# EAGLE design commonBoardPtV0.5-2014-11-05 (EAGLE 7.1.0)
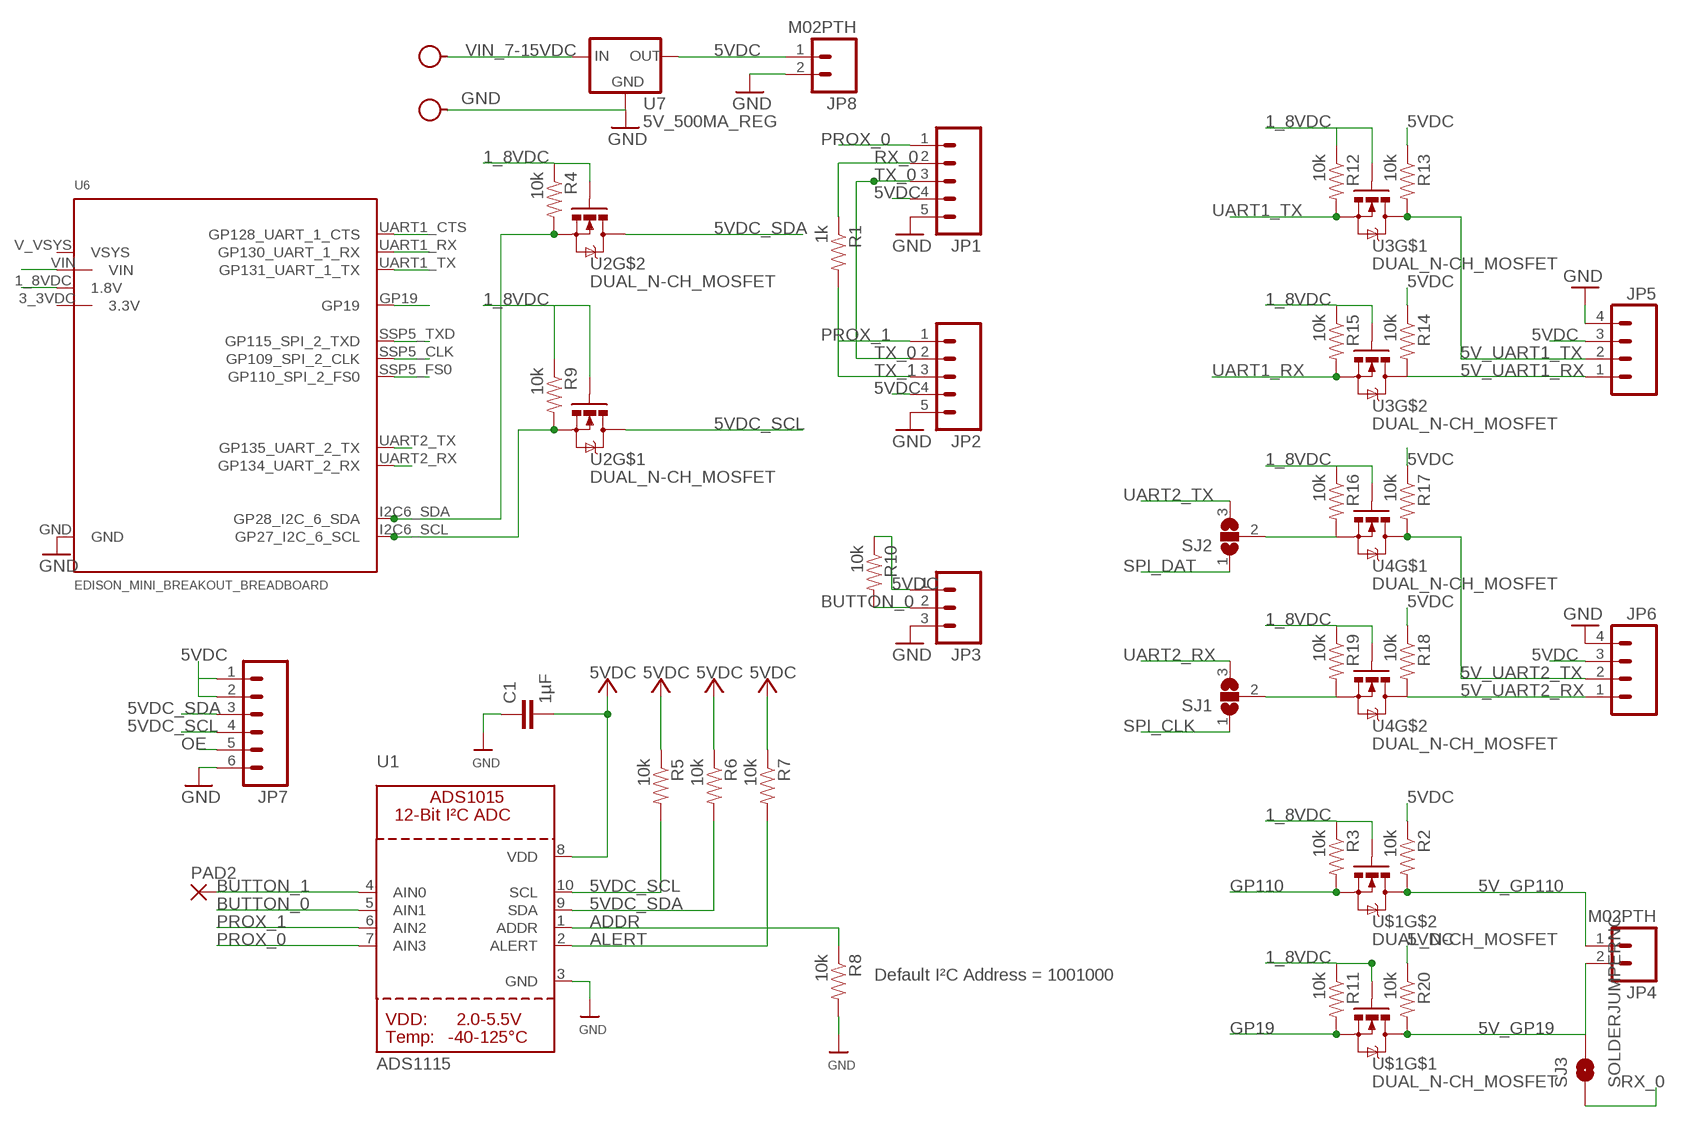
[diagram p0: schematic, sheet 1]

## Parts
C1  1µF  CAP0603-CAP  [0603-CAP]
GND  SEW_HOLE-SMALL  [SIMPLE_HOLE_SM]
JP1  M05PTH  [1X05]
JP2  M05PTH  [1X05]
JP3  M03PTH  [1X03]
JP4  M02PTH  [1X02]
JP5  M04PTH  [1X04]
JP6  M04PTH  [1X04]
JP7  M06SIP  [1X06]
JP8  M02PTH  [1X02]
PAD2  2,15/1,0  [2,15/1,0]
R1  1k  RESISTOR0603-RES  [0603-RES]
R2  10k  RESISTOR0603-RES  [0603-RES]
R3  10k  RESISTOR0603-RES  [0603-RES]
R4  10k  RESISTOR0603-RES  [0603-RES]
R5  10k  RESISTOR0603-RES  [0603-RES]
R6  10k  RESISTOR0603-RES  [0603-RES]
R7  10k  RESISTOR0603-RES  [0603-RES]
R8  10k  RESISTOR0603-RES  [0603-RES]
R9  10k  RESISTOR0603-RES  [0603-RES]
R10  10k  RESISTOR0603-RES  [0603-RES]
R11  10k  RESISTOR0603-RES  [0603-RES]
R12  10k  RESISTOR0603-RES  [0603-RES]
R13  10k  RESISTOR0603-RES  [0603-RES]
R14  10k  RESISTOR0603-RES  [0603-RES]
R15  10k  RESISTOR0603-RES  [0603-RES]
R16  10k  RESISTOR0603-RES  [0603-RES]
R17  10k  RESISTOR0603-RES  [0603-RES]
R18  10k  RESISTOR0603-RES  [0603-RES]
R19  10k  RESISTOR0603-RES  [0603-RES]
R20  10k  RESISTOR0603-RES  [0603-RES]
SJ1  SJ2W  [SJ_2]
SJ2  SJ2W  [SJ_2]
SJ3  SOLDERJUMPERNC  [SJ_2S]
U1  ADS1115  ADC_ADS1015  [MSOP10]
U2  DUAL_N-CH_MOSFET  [SOT363_DUAL_N_MOSFET]
U3  DUAL_N-CH_MOSFET  [SOT363_DUAL_N_MOSFET]
U4  DUAL_N-CH_MOSFET  [SOT363_DUAL_N_MOSFET]
U6  EDISON_MINI_BREAKOUT_BREADBOARD  [EDISON_MINI_BREAK_BREADBOARD]
U7  5V_500MA_REG  [5V_500MA_REG]
U$1  DUAL_N-CH_MOSFET  [SOT363_DUAL_N_MOSFET]
VIN_7-15VDC  SEW_HOLE-SMALL  [SIMPLE_HOLE_SM]

## Nets
1_8VDC: R3.1 R4.1 R9.1 R11.1 R12.1 R15.1 R16.1 R19.1 U2.2(G) U2.5(G) U3.2(G) U3.5(G) U4.2(G) U4.5(G) U6.1_8VDC(1.8V) U$1.2(G) U$1.5(G)
5V_GP19: JP4.2 R20.2 SJ3.2 U$1.3(D)
5V_GP110: JP4.1 R2.2 U$1.6(D)
5V_UART1_RX: JP5.1 R14.2 U3.6(D)
5V_UART1_TX: JP5.2 R13.2 U3.3(D)
5V_UART2_RX: JP6.1 R18.2 U4.6(D)
5V_UART2_TX: JP6.2 R17.2 U4.3(D)
5VDC: C1.2 JP1.4 JP2.4 JP3.1 JP5.3 JP6.3 JP7.1 JP7.2 JP8.1 R2.1 R5.1 R6.1 R7.1 R10.1 R13.1 R14.1 R17.1 R18.1 R20.1 U1.8(VDD) U7.OUT ; supply symbol labelled VDD
5VDC_SCL: JP7.4 R5.2 U1.10(SCL) U2.3(D)
5VDC_SDA: JP7.3 R6.2 U1.9(SDA) U2.6(D)
ADDR: R8.1 U1.1(ADDR)
ALERT: R7.2 U1.2(ALERT)
BUTTON_0: JP3.2 R10.2 U1.5(AIN1)
BUTTON_1: PAD2.1(P) U1.4(AIN0)
GND: C1.1 GND.P$1 JP1.5 JP2.5 JP3.3 JP5.4 JP6.4 JP7.6 JP8.2 R8.2 U1.3(GND) U6.GND U7.GND
GP19: R11.2 U6.GP19 U$1.4(S)
GP110: R3.2 U6.SSP5_FS0(GP110_SPI_2_FS0) U$1.1(S)
N$1: R9.2 U2.4(S) U6.I2C6_SCL(GP27_I2C_6_SCL)
N$2: U6.UART1_CTS(GP128_UART_1_CTS)
N$4: R4.2 U2.1(S) U6.I2C6_SDA(GP28_I2C_6_SDA)
OE: JP7.5
P1: R16.2 SJ2.2 U4.4(S)
P2: R19.2 SJ1.2 U4.1(S)
PROX_0: JP1.1 U1.7(AIN3)
PROX_1: JP2.1 U1.6(AIN2)
RX_0: JP1.2 R1.1 SJ3.1
SPI_CLK: SJ1.1 U6.SSP5_CLK(GP109_SPI_2_CLK)
SPI_DAT: SJ2.1 U6.SSP5_TXD(GP115_SPI_2_TXD)
TX_0: JP1.3 JP2.2
TX_1: JP2.3 R1.2
UART1_RX: R15.2 U3.1(S) U6.UART1_RX(GP130_UART_1_RX)
UART1_TX: R12.2 U3.4(S) U6.UART1_TX(GP131_UART_1_TX)
UART2_RX: SJ1.3 U6.UART2_RX(GP134_UART_2_RX)
UART2_TX: SJ2.3 U6.UART2_TX(GP135_UART_2_TX)
VIN_7-15VDC: U6.VIN U7.IN VIN_7-15VDC.P$1
Unconnected: U6.3_3VDC(3.3V) U6.V_VSYS(VSYS)

## Notes on the sheet
- Default I²C Address = 1001000

## Library data of the parts
C1 = SparkFun-Capacitors:CAP: Capacitor Standard 0603 ceramic capacitor, and 0.1" leaded capacitor.
GND VIN_7-15VDC = LilyPad-Wearables:SEW_HOLE-SMALL: .070" hole with 20mil annular ring
JP1 JP2 = SparkFun-Connectors:M05: Header 5 Standard 5-pin 0.1" header. Use with straight break away headers (SKU : PRT-00116), right angle break away headers (PRT-00553), swiss pins (PRT-00743), machine pins (PRT-00117), and female headers (PRT-00115). Molex polarized connector foot print use with SKU : PRT-08230 with associated crimp pins and housings.
JP3 = SparkFun-Connectors:M03: Header 3 Standard 3-pin 0.1" header. Use with straight break away headers (SKU : PRT-00116), right angle break away headers (PRT-00553), swiss pins (PRT-00743), machine pins (PRT-00117), and female headers (PRT-00115). Molex polarized connector foot print use with SKU : PRT-08232 with associated crimp pins and housings.
JP4 JP8 = SparkFun-Connectors:M02: Standard 2-pin 0.1" header. Use with - straight break away headers ( PRT-00116) - right angle break away headers (PRT-00553) - swiss pins (PRT-00743) - machine pins (PRT-00117) - female headers (PRT-00115) Molex polarized connector foot print use with: PRT-08233 with associated crimp pins and housings. 2.54_SCREWTERM for use with PRT-10571. 3.5mm Screw Terminal footprints for PRT-08084 5mm Screw Terminal footprints for use with PRT-08433
JP5 JP6 = SparkFun-Connectors:M04: Header 4 Standard 4-pin 0.1" header. Use with straight break away headers (SKU : PRT-00116), right angle break away headers (PRT-00553), swiss pins (PRT-00743), machine pins (PRT-00117), and female headers (PRT-00115). Molex polarized connector foot print use with SKU : PRT-08231 with associated crimp pins and housings. 1MM SMD Version SKU: PRT-10208
JP7 = SparkFun-Connectors:M06: Header 6 Standard 6-pin 0.1" header. Use with straight break away headers (SKU : PRT-00116), right angle break away headers (PRT-00553), swiss pins (PRT-00743), machine pins (PRT-00117), and female headers (PRT-00115). Molex polarized connector foot print use with SKU : PRT-08094 with associated crimp pins and housings. NOTES ON THE VARIANTS LOCK and LOCK_LONGPADS... This footprint was designed to help hold the alignment of a through-hole component (i.e. 6-pin header) while soldering it into place. You may notice that each hole has been shifted either up or down by 0.005 of an inch from it's more standard position (which is a perfectly straight line). This slight alteration caused the pins (the squares in the middle) to touch the edges of the holes. Because they are alternating, it causes a "brace" to hold the component in place. 0.005 has proven to be the perfect amount of "off-center" position when using our standard breakaway headers. Although looks a little odd when you look at the bare footprint, once you have a header in there, the alteration is very hard to notice. Also,if you push a header all the way into place, it is covered up entirely on the bottom side. This idea of altering the position of holes to aid alignment will be further integrated into the Sparkfun Library for other footprints. It can help hold any component with 3 or more connection pins.
PAD2 = wirepad:2,15/1,0: THROUGH-HOLE PAD
R1-R20 = SparkFun-Passives:RESISTOR: Resistor Basic schematic elements and footprints for 0603, 1206, and PTH resistors.
SJ1 SJ2 = jumper:SJ2W: SMD solder JUMPER
SJ3 = SparkFun-Passives:SOLDERJUMPER: Solder Jumper Standard SMD solder jumper. Used to automate production. Two varients : Normally Open and Normally Closed are the same, but have different paste layers. NC will have a large amount of paste and should jumper during reflow.
U1 = microbuilder:ADC_ADS1015: ADS1015 - 12-bit 4-Channel I2C ADC with Internal PGA VDD: 2.0-5.5V Sampling Rate: 3.3ksps Gain Settings: 2/3, 1, 2, 4, 8, 16 I2C Address: ADDR low = 1001000x, ADDR high = 1001001x Internal Comparator The ADS1015 includes an internal comparator that can be set to output a high-level on ALERT when the conversion results exceeeds a pre-defined upper level, and will deassert itself when the level falls below a pre-defined lower threshold level. It can also be set to windowed mode where the ALERT pin will be asserted if the data exceeds the upper threshold or falls below the lower threshold.
U2-U4 U$1 = bss138_part:DUAL_N-CH_MOSFET
U6 = Edison:EDISON_MINI_BREAKOUT_BREADBOARD
U7 = pololu:5V_500MA_REG

## Board
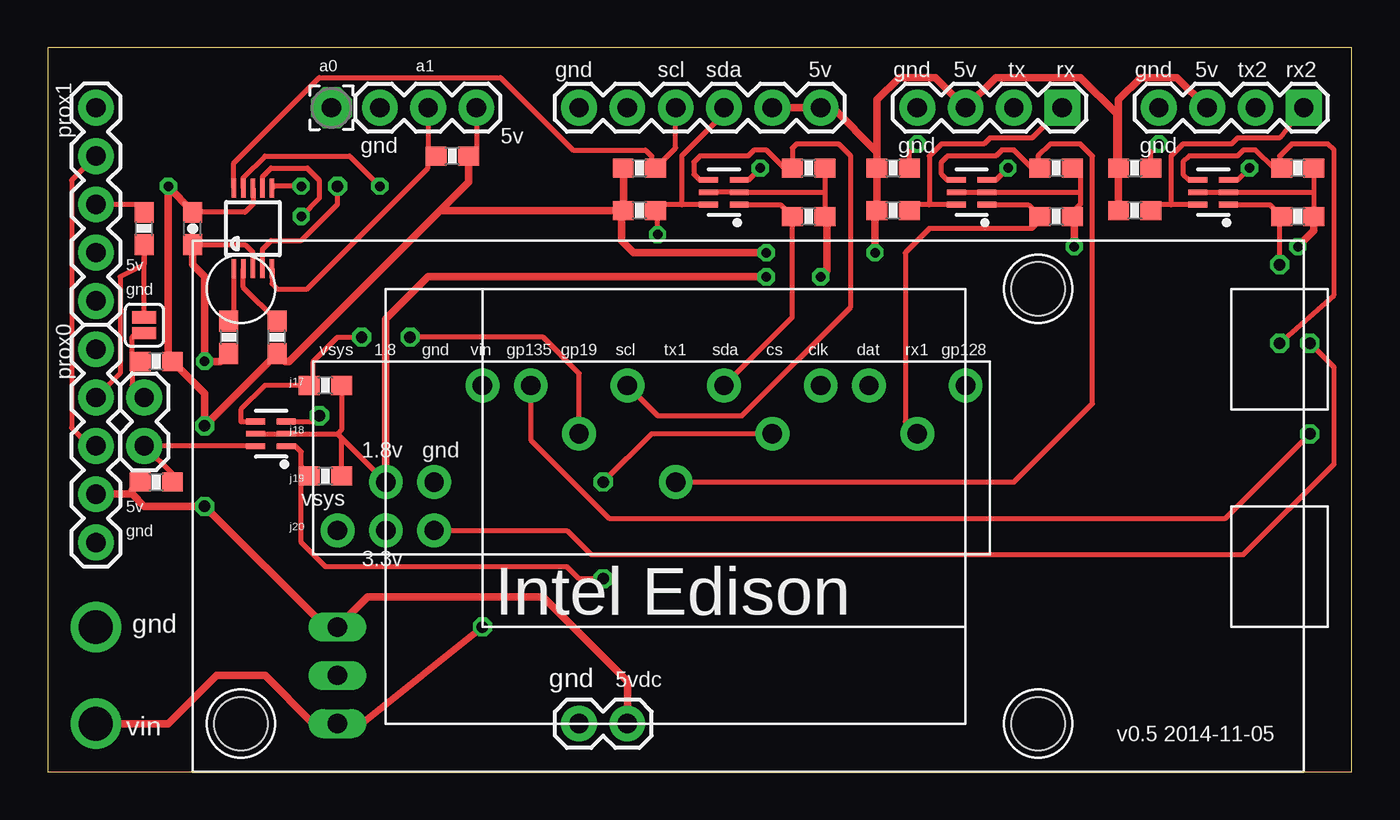
[diagram p1: board, top side]
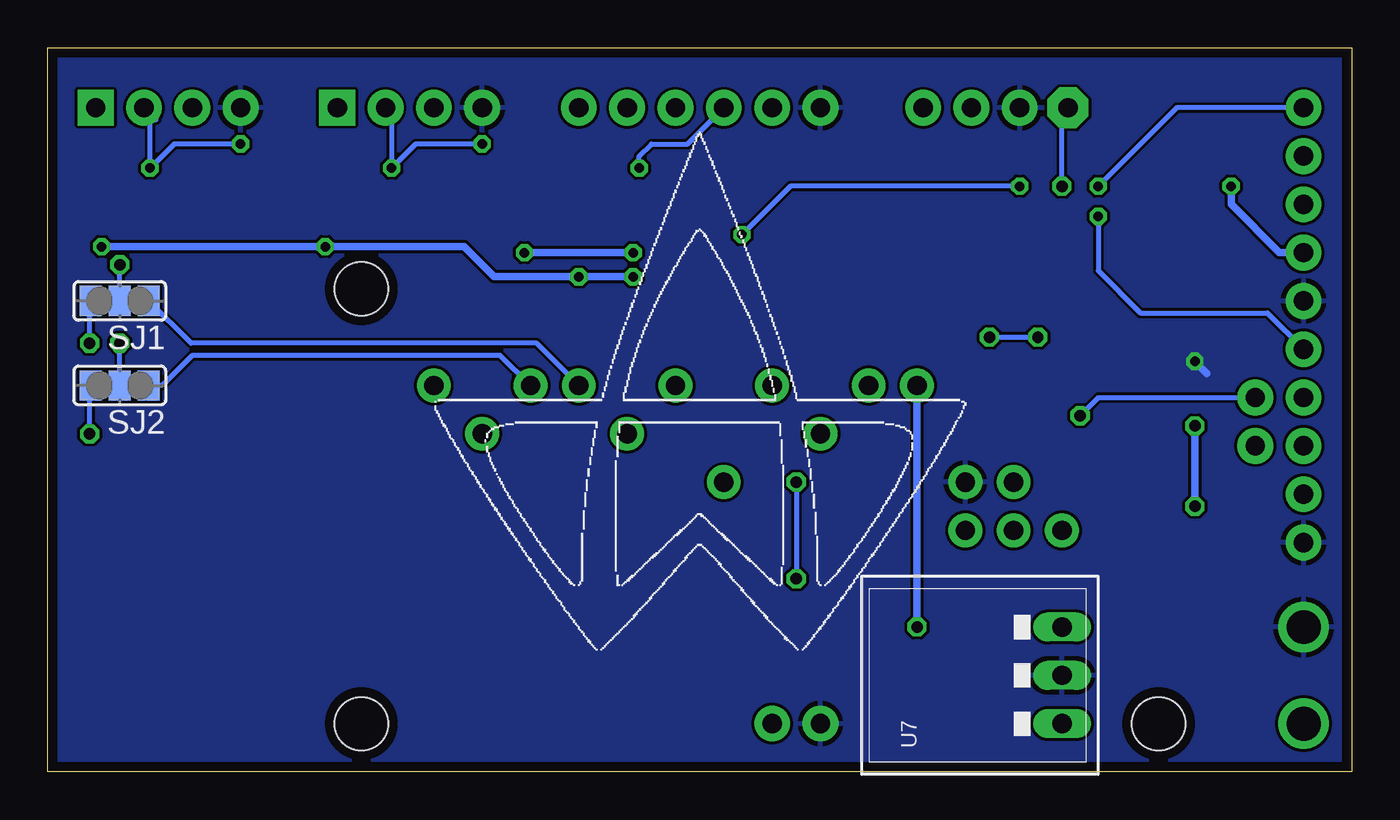
[diagram p2: board, bottom side, seen from below]

Size 68.57 x 38.09 mm. Coordinates in mm from the lower left corner, seen from the top.
Outline: 0,0 68.57,0 68.57,38.09 0,38.09 0,0
Copper layers (1*16): Top 0.0178mm / dielectric 59mil / Bottom 0.0178mm
Design rules "SSC-EAGLE-2Lyr_v1.0.0.3": minimum track width 6mil, minimum drill 14mil, track to track 6mil, track to pad 6mil, pad to pad 6mil, via to via 6mil, smd to smd 6mil, copper to edge 20mil, drill to drill 16mil, minimum pad ring 8mil, minimum via ring 8mil, stop-mask expansion 3mil, vias tented up to drill 0mil, thermal gap 10mil
Holes 2.8 mm at 10.16,2.54 52.07,2.54 52.07,25.4

### Footprints (pad centres in the part's own frame; a part is rotated, then mirrored left to right if it is on the bottom)
0603-CAP = smd 1.1 x 1: 1 -0.85,0; 2 0.85,0
SIMPLE_HOLE_SM = drill 1.778 pad 2.286: P$1 0,0
1X05 = drill 1.016 pad 1.88: 1 0,0; 2 2.54,0; 3 5.08,0; 4 7.62,0; 5 10.16,0
1X03 = drill 1.016 pad 1.88: 1 0,0; 2 2.54,0; 3 5.08,0
1X02 = drill 1.016 pad 1.88: 1 0,0; 2 2.54,0
1X04 = drill 1.016 pad 1.88 square: 1 0,0 | drill 1.016 pad 1.88: 2 2.54,0; 3 5.08,0; 4 7.62,0
1X06 = drill 1.016 pad 1.88: 1 0,0; 2 2.54,0; 3 5.08,0; 4 7.62,0; 5 10.16,0; 6 12.7,0
2,15/1,0 = drill 1.016 pad 2.159 octagon: 1 0,0
0603-RES = smd 1.1 x 1: 1 -0.85,0; 2 0.85,0
SJ_2 = smd 1.168 x 1.6: 1 -1.524,0; 2 0,0; 3 1.524,0
SJ_2S = smd 0.635 x 1.27: 1 -0.412,0; 2 0.412,0
MSOP10 = smd 0.25 x 1: 1 -1,-2.113; 2 -0.5,-2.113; 3 0,-2.113; 4 0.5,-2.113; 5 1,-2.113; 6 1,2.113; 7 0.5,2.113; 8 0,2.113; 9 -0.5,2.113; 10 -1,2.113
SOT363_DUAL_N_MOSFET = smd 0.3 x 0.99: 1 -0.65,-0.8; 2 0,-0.8; 3 0.65,-0.8; 4 0.65,0.81; 5 0,0.81; 6 -0.65,0.81
EDISON_MINI_BREAK_BREADBOARD = drill 1.016 pad 1.778: 1_8VDC 2.54,2.54; 3_3VDC 2.54,0; GND 5.08,2.54; GP19 12.7,5.08; I2C6_SCL 15.24,7.62; I2C6_SDA 20.32,7.62; SSP5_CLK 25.4,7.62; SSP5_FS0 22.86,5.08; SSP5_TXD 27.94,7.62; UART1_CTS 33.02,7.62; UART1_RX 30.48,5.08; UART1_TX 17.78,2.54; UART2_RX 5.08,0; UART2_TX 10.16,7.62; V_VSYS 0,0; VIN 7.62,7.62
5V_500MA_REG = drill 1.016 long: GND 0,0; IN -2.54,0; OUT 2.54,0

### Placement (x,y rotation side)
C1  7.62,28.57 90 top
GND  2.54,7.62 0 top
JP1  2.54,22.23 270 top
JP2  2.54,34.92 270 top
JP3  22.54,34.92 180 top
JP4  5.08,17.14 90 top
JP5  53.34,34.92 180 top
JP6  66.04,34.92 180 top
JP7  40.64,34.92 180 top
JP8  30.48,2.54 180 top
PAD2  14.92,34.92 0 top
R1  5.08,28.57 90 top
R2  5.71,15.24 0 top
R3  14.61,15.56 180 top
R4  40.01,29.21 180 top
R5  31.11,31.75 0 top
R6  31.11,29.53 0 top
R7  12.06,22.86 90 top
R8  9.53,22.86 270 top
R9  40.01,31.75 180 top
R10  21.27,32.38 180 top
R11  14.61,20.32 180 top
R12  53.02,31.75 180 top
R13  44.45,31.75 0 top
R14  44.45,29.53 0 top
R15  53.02,29.21 180 top
R16  65.72,31.75 180 top
R17  57.15,31.75 0 top
R18  57.15,29.53 0 top
R19  65.72,29.21 180 top
R20  5.71,21.59 180 top
SJ1  64.77,24.77 180 bottom
SJ2  64.77,20.32 180 bottom
SJ3  5.08,23.5 270 top
U1  10.79,28.57 0 top
U2  35.56,30.48 90 top
U3  48.58,30.48 90 top
U4  61.28,30.48 90 top
U6  15.24,12.7 0 top
U7  15.24,5.08 90 bottom
U$1  11.75,17.78 90 top
VIN_7-15VDC  2.54,2.54 0 top

### Tracks (layer width: path | path; a pad name or v marks a point on that pad's centre or on a via)
1_8VDC  (via drill 0.5)
  Top 0.254: U3.5 U3.2 54.29,30.48 | R12.1 54.29,31.33 54.29,30.48 | 54.29,30.48 54.29,29.84 53.87,29.43 R15.1 | R16.1 66.57,30.48 | 66.57,30.48 R19.1 | 66.57,30.48 U4.2 U4.5 | U2.5 U2.2 40.85,30.48 | R9.1 40.85,30.48 | 40.85,30.48 R4.1 | 15.46,17.57 U6.1_8VDC | 15.24,17.78 U$1.2 U$1.5 | R11.1 15.46,18 15.24,17.78 | R3.1 15.46,17.57 | 15.46,17.57 15.24,17.78
  Top 0.406: v37.78,26.04 20,26.04 17.78,23.81 U6.1_8VDC 17.78,17.14 | v40.64,26.04 40.96,26.35 40.96,29.11 R4.1 | v65.72,27.62 66.57,28.47 R19.1 | R15.1 53.98,29.21 v53.98,27.62
  Bottom 0.406: v37.78,26.04 v40.64,26.04 45.09,26.04 46.67,27.62 v53.98,27.62 v65.72,27.62
5V_GP19  (via drill 0.6)
  Top 0.254: U$1.3 13.98,18.43 v14.29,18.73 | SJ3.2 4.57,22.99 4.45,22.86 4.45,22.01 | 4.45,22.01 4.45,20.32 JP4.2 | R20.2 4.45,22.01
  Bottom 0.254: v14.29,18.73 13.34,19.68 JP4.2
5V_GP110
  Top 0.254: U$1.6 10.92,17.14 JP4.1 6.57,15.66 R2.2
5V_UART1_RX
  Top 0.254: U3.6 46.35,29.83 | 46.35,29.83 45.6,29.83 R14.2 | JP5.1 51.75,33.34 49.53,33.34 49.21,33.02 46.99,33.02 46.35,32.38 46.35,29.83
5V_UART1_TX  (via drill 0.5)
  Top 0.254: U3.3 49.86,31.13 v50.48,31.75 | R13.2 45.3,32.6 v45.72,33.02
  Bottom 0.254: JP5.2 50.48,34.61 v50.48,31.75 49.21,33.02 v45.72,33.02
5V_UART2_RX
  Top 0.254: U4.6 59.05,29.83 | 59.05,29.83 58.3,29.83 R18.2 | JP6.1 64.77,33.34 62.55,33.34 62.23,33.02 59.69,33.02 59.05,32.38 59.05,29.83
5V_UART2_TX  (via drill 0.5)
  Top 0.254: U4.3 62.56,31.13 v63.18,31.75 | R17.2 58,32.6 v58.42,33.02
  Bottom 0.254: 62.87,34.29 JP6.2 63.18,34.61 v63.18,31.75 61.91,33.02 v58.42,33.02
5VDC  (via drill 0.5, 0.6)
  Top 0.254: U1.8 10.79,29.84 10.38,29.43 C1.2 | JP3.1 22.54,32.8 R10.1
  Top 0.406: C1.2 v6.35,30.8 6.35,21.8 R20.1 8.26,19.9 v8.26,18.2 R7.1 12.48,21.59 12.7,21.59 20.64,29.53 | 20.64,29.53 R6.1 | R5.1 R6.1 | JP7.2 JP7.1 41.27,34.92 43.6,32.6 R13.1 | v37.78,27.3 30.8,27.3 30.16,27.94 30.16,29.43 R6.1 | v43.5,27.3 43.5,29.43 R14.1 R13.1 | R13.1 43.6,35.34 44.77,36.51 46.67,36.51 JP5.3 49.85,36.51 54.29,36.51 56.2,34.61 56.2,31.85 R17.1 | R17.1 56.3,35.34 57.47,36.51 59.37,36.51 JP6.3 | R10.1 22.12,31.01 20.64,29.53 | R17.1 R18.1 | 4.45,14.61 5.08,13.97 v8.26,13.97 14.61,7.62 U7.OUT 16.83,9.21 26.04,9.21 30.48,4.76 JP8.1 | 4.45,14.61 4.45,14.82 R2.1 | JP1.4 4.45,14.61
  Bottom 0.406: JP2.4 3.81,27.3 6.35,29.84 v6.35,30.8 | v43.5,27.3 v37.78,27.3 | v8.26,13.97 v8.26,18.2
5VDC_SCL  (via drill 0.5)
  Top 0.254: U2.3 36.84,31.13 v37.47,31.75 | JP7.4 33.02,32.8 R5.2 31.75,31.96 31.75,32.38 31.43,32.7 27.62,32.7 23.81,36.51 14.29,36.51 9.79,32.02 U1.10
  Bottom 0.254: v37.47,31.75 37.47,32.38 36.83,33.02 34.92,33.02 JP7.4
5VDC_SDA  (via drill 0.5)
  Top 0.254: U2.6 33.34,29.83 | 33.34,29.83 32.27,29.83 R6.2 32.07,29.43 v32.07,28.26 | JP7.3 35.56,34.61 33.34,32.38 33.34,29.83 | U1.9 10.29,31.25 11.43,32.38 15.88,32.38 v17.46,30.8
  Bottom 0.254: v17.46,30.8 29.53,30.8 v32.07,28.26
ADDR
  Top 0.254: U1.1 9.79,23.98 R8.1
ALERT
  Top 0.254: R7.2 10.29,25.48 U1.2
BUTTON_0
  Top 0.254: U1.5 11.79,25.67 12.06,25.4 13.65,25.4 20,31.75 20,32.07 20,32.28 | 20,32.28 R10.2 | JP3.2 20,32.28
BUTTON_1  (via drill 0.6)
  Top 0.254: U1.4 11.29,27.49 11.75,27.94 13.34,27.94 15.24,29.84 v15.24,30.8
  Bottom 0.254: v15.24,30.8 15.24,34.61 PAD2.1
GND  (via drill 0.5)
  Top 0.254: U1.3 10.79,27.3 10.38,27.73 C1.1
  Top 0.406: R8.2 9.11,21.59 v8.26,21.59 8.26,26.04 7.62,26.67 C1.1
  Bottom 0.406: v8.26,21.59 7.62,20.95
  pour Bottom: 0,0 68.58,0 68.58,38.1 0,38.1
GP19  (via drill 0.6)
  Top 0.254: U$1.4 10.92,18.41 10.16,18.41 10.16,19.05 11.43,20.32 R11.2 13.97,20.32 13.97,21.59 15.24,22.86 v16.51,22.86 | U6.GP19 27.94,20.95 26.04,22.86 v19.05,22.86
  Bottom 0.254: v19.05,22.86 v16.51,22.86
GP110  (via drill 0.6)
  Top 0.254: U6.SSP5_FS0 31.75,17.78 v29.21,15.24 | v29.21,10.16 27.94,10.16 27.3,10.79 14.61,10.79 13.34,12.06 13.34,16.09 | 13.34,16.09 R3.2 | 13.34,16.09 13.34,16.83 13.02,17.14 12.56,17.14 U$1.1
  Bottom 0.254: v29.21,15.24 v29.21,10.16
N$1
  Top 0.254: U2.4 34.73,31.11 34.29,31.11 33.97,31.43 33.97,32.07 34.29,32.38 36.83,32.38 37.15,32.7 37.78,32.7 38.73,31.75 R9.2 39.16,32.8 39.37,33.02 41.59,33.02 42.23,32.38 42.23,24.45 36.51,18.73 32.07,18.73 U6.I2C6_SCL
N$4
  Top 0.254: U2.1 38.53,29.83 R4.2 39.16,23.91 U6.I2C6_SDA
P1  (via drill 0.6)
  Top 0.254: U4.4 60.45,31.11 60.01,31.11 59.69,31.43 59.69,32.07 60.01,32.38 62.55,32.38 62.87,32.7 63.5,32.7 64.45,31.75 R16.2 64.77,31.85 64.77,32.38 65.41,33.02 67.31,33.02 67.63,32.7 67.63,25.08 v64.77,22.54
  Bottom 0.254: SJ2.2 v64.77,22.54
P2  (via drill 0.6)
  Top 0.254: U4.1 64.25,29.83 R19.2 64.77,29.11 v64.77,26.67
  Bottom 0.254: SJ1.2 v64.77,26.67
PROX_0  (via drill 0.5)
  Top 0.254: U1.7 11.29,31.3 11.75,31.75 13.65,31.75 14.29,31.11 14.29,30.16 v13.34,29.21
  Bottom 0.254: JP1.1 4.45,24.13 11.11,24.13 13.34,26.35 v13.34,29.21
PROX_1  (via drill 0.5)
  Top 0.254: v13.34,30.8 11.9,30.8 U1.6
  Bottom 0.254: JP2.1 9.21,34.92 v13.34,30.8
RX_0
  Top 0.254: JP1.2 3.81,20.95 3.81,26.04 5.08,26.67 R1.1 SJ3.1
SPI_CLK
  Bottom 0.254: U6.SSP5_CLK 42.86,22.54 61.02,22.54 SJ1.1
SPI_DAT
  Bottom 0.254: U6.SSP5_TXD 44.77,21.91 60.96,21.91 62.55,20.32 SJ2.1
TX_0
  Top 0.254: JP2.2 1.27,31.11 1.27,18.1 2.22,17.14 JP1.3
TX_1
  Top 0.254: JP2.3 4.66,29.84 R1.2
UART1_RX
  Top 0.254: U3.1 51.55,29.83 R15.2 52.07,29.11 52.07,28.89 51.75,28.57 46.35,28.57 45.09,27.3 45.09,18.41 U6.UART1_RX
UART1_TX
  Top 0.254: U3.4 47.75,31.11 47.31,31.11 46.99,31.43 46.99,32.07 47.31,32.38 49.85,32.38 50.16,32.7 50.8,32.7 51.75,31.75 R12.2 52.07,31.85 52.07,32.38 52.7,33.02 54.29,33.02 54.93,32.38 54.93,19.37 50.8,15.24 U6.UART1_TX
UART2_RX  (via drill 0.6)
  Top 0.254: U6.UART2_RX 27.3,12.7 28.57,11.43 62.87,11.43 67.63,16.19 67.63,21.27 v66.36,22.54
  Bottom 0.254: v66.36,22.54 66.36,24.7 SJ1.3
UART2_TX  (via drill 0.6)
  Top 0.254: U6.UART2_TX 25.4,17.46 29.53,13.34 61.91,13.34 v66.36,17.78
  Bottom 0.254: v66.36,17.78 66.36,20.26 SJ2.3
VIN_7-15VDC  (via drill 0.6)
  Top 0.406: VIN_7-15VDC.P$1 6.35,2.54 8.89,5.08 11.43,5.08 13.97,2.54 U7.IN 16.51,2.54 v22.86,7.62
  Bottom 0.406: v22.86,7.62 U6.VIN

### Text on the board
tPlace: a0 | a1 | 5v | gnd | 5v | gnd | 5vdc | v0.5 2014-11-05
tNames: gnd | scl | sda | 5v | gnd | 5v | tx | rx | gnd | 5v | tx2 | rx2 | prox1 | gnd | 5v | gnd | gnd | prox0 | 1.8v | gnd | vsys | 3.3v | gnd | gnd | vin